# Altium schematic sheet dcdc_jetson.SchDoc
size A3; SheetNumber: 3; SheetTotal: 3
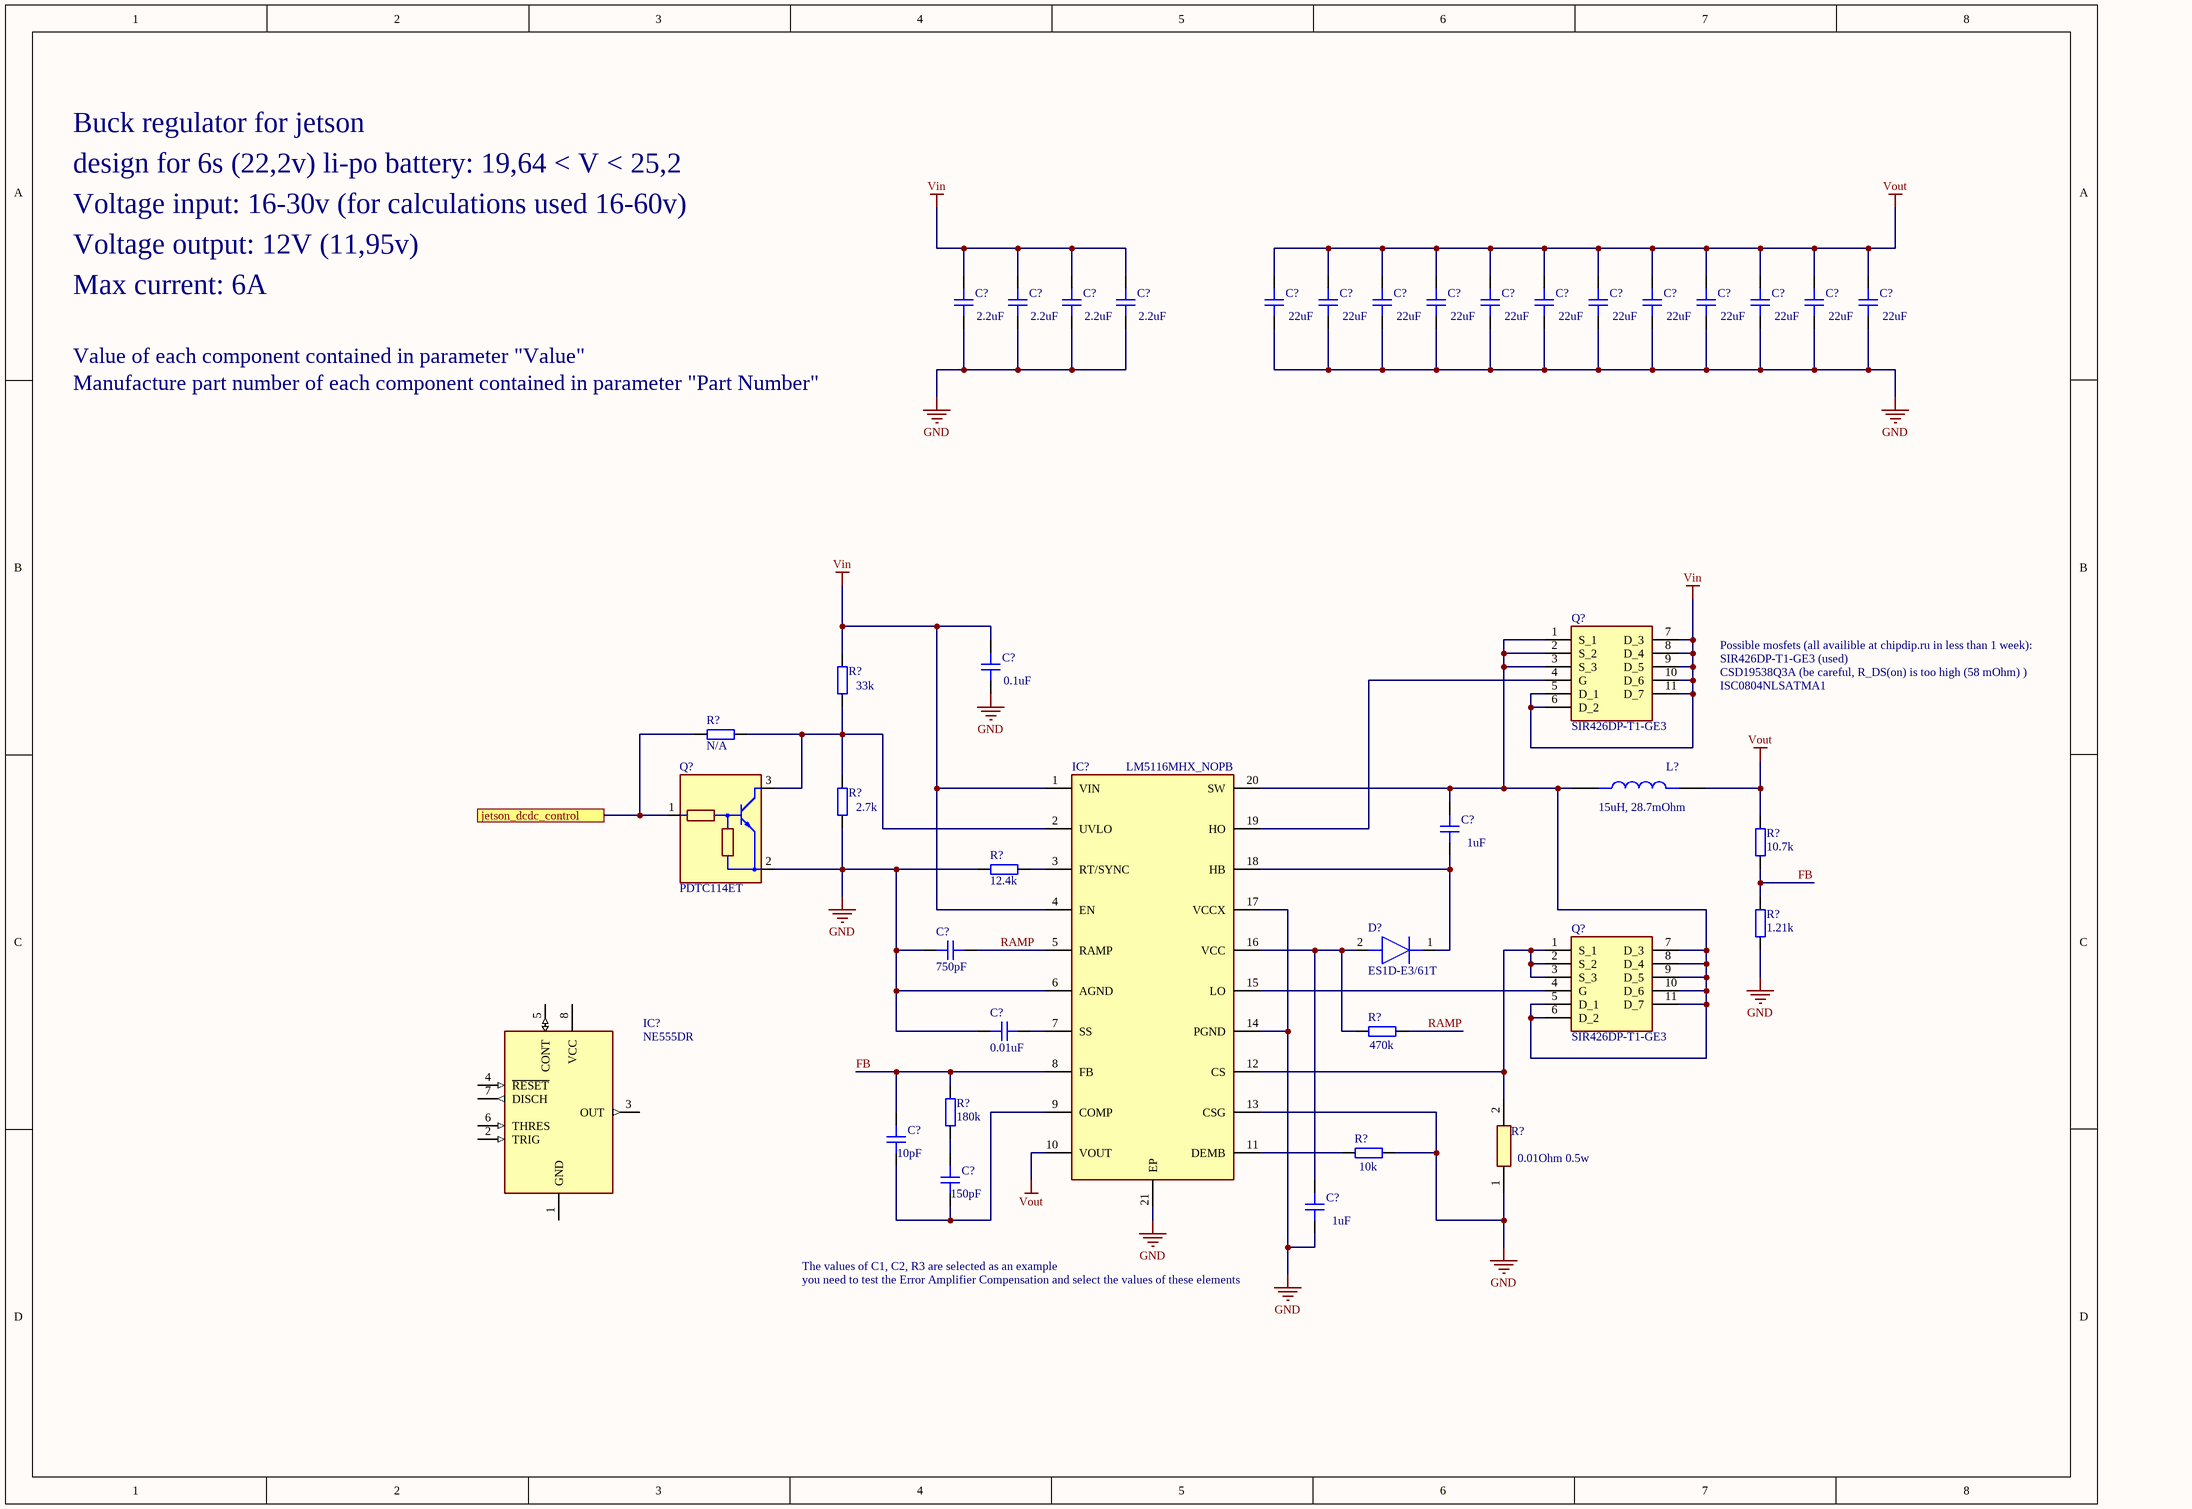
[diagram p0: dcdc_jetson.SchDoc]

## Parts
(Parts that share a designator on the sheet are numbered #1, #2 ... from top to bottom, then left to right.)
C?#1  value 2.2uF  [CAP_1206]  (hidden comment: C1206)
C?#2  value 2.2uF  [CAP_1206]  (hidden comment: C1206)
C?#3  value 2.2uF  [CAP_1206]  (hidden comment: C1206)
C?#4  value 2.2uF  [CAP_1206]  (hidden comment: C1206)
C?#5  value 22uF  [CAP_1210]  (hidden comment: C1210)
C?#6  value 22uF  [CAP_1210]  (hidden comment: C1210)
C?#7  value 22uF  [CAP_1210]  (hidden comment: C1210)
C?#8  value 22uF  [CAP_1210]  (hidden comment: C1210)
C?#9  value 22uF  [CAP_1210]  (hidden comment: C1210)
C?#10  value 22uF  [CAP_1210]  (hidden comment: C1210)
C?#11  value 22uF  [CAP_1210]  (hidden comment: C1210)
C?#12  value 22uF  [CAP_1210]  (hidden comment: C1210)
C?#13  value 22uF  [CAP_1210]  (hidden comment: C1210)
C?#14  value 22uF  [CAP_1210]  (hidden comment: C1210)
C?#15  value 22uF  [CAP_1210]  (hidden comment: C1210)
C?#16  value 22uF  [CAP_1210]  (hidden comment: C1210)
C?#17  value 0.1uF  [CAP_0603]  (hidden comment: C0603)
C?#18  value 1uF  [CAP_0603]  (hidden comment: C0603)
C?#19  value 750pF  [CAP_0603]  (hidden comment: C0603)
C?#20  value 0.01uF  [CAP_0603]  (hidden comment: C0603)
C?#21  value 10pF  [CAP_0603]  (hidden comment: C0603)
C?#22  value 150pF  [CAP_0603]  (hidden comment: C0603)
C?#23  value 1uF  [CAP_0603]  (hidden comment: C0603)
D?  Part Number: ES1D-E3/61T  [DIOM5127X229N]
IC?#1  NE555DR  [SOIC127P600X175-8N]
IC?#2  LM5116MHX_NOPB  [SOP65P640X110-21N]
L?  value 15uH, 28.7mOhm  [IND_SPRH127-560M]
Q?#1  (no value)  [SIR426DPT1GE3]
Q?#2  PDTC114ET  [SOT95P230X110-3N]
Q?#3  (no value)  [SIR426DPT1GE3]
R?#1  value 33k  [RES_0603]  (hidden comment: R0603)
R?#2  R0603  [RES_0603]  (value not drawn)
R?#3  value 2.7k  [RES_0603]  (hidden comment: R0603)
R?#4  value 10.7k  [RES_0402]  (hidden comment: R0402)
R?#5  value 12.4k  [RES_0603]  (hidden comment: R0603)
R?#6  value 1.21k  [RES_0402]  (hidden comment: R0402)
R?#7  value 470k  [RES_0603]  (hidden comment: R0603)
R?#8  value 180k  [RES_0603]  (hidden comment: R0603)
R?#9  value 10k  [RES_0603]  (hidden comment: R0603)
R?#10  value 0.01Ohm 0.5w  [RESC3126X65N]

## Ports
jetson_dcdc_control

## Nets
GND: C?#1.1 C?#2.1 C?#3.1 C?#4.1 C?#5.1 C?#6.1 C?#7.1 C?#8.1 C?#9.1 C?#10.1 C?#11.1 C?#12.1 C?#13.1 C?#14.1 C?#15.1 C?#16.1 C?#17.1 C?#19.2 C?#20.2 C?#23.1 IC?#2.6(AGND) IC?#2.13(CSG) IC?#2.14(PGND) IC?#2.17(VCCX) IC?#2.21(EP) Q?#2.2(E) R?#3.1 R?#5.2 R?#6.1 R?#9.2 R?#10.1
Vin: C?#1.2 C?#2.2 C?#3.2 C?#4.2 C?#17.2 IC?#2.1(VIN) IC?#2.4(EN) Q?#1.5(D_1) Q?#1.6(D_2) Q?#1.7(D_3) Q?#1.8(D_4) Q?#1.9(D_5) Q?#1.10(D_6) Q?#1.11(D_7) R?#1.2
Vout: C?#5.2 C?#6.2 C?#7.2 C?#8.2 C?#9.2 C?#10.2 C?#11.2 C?#12.2 C?#13.2 C?#14.2 C?#15.2 C?#16.2 IC?#2.10(VOUT) L?.2 R?#4.1
FB: C?#21.2 IC?#2.8(FB) R?#4.2 R?#6.2 R?#8.1
jetson_dcdc_control: Q?#2.1(B) R?#2.2 ; port jetson_dcdc_control
RAMP: C?#19.1 IC?#2.5(RAMP) R?#7.2
NetC?#18_1: C?#18.1 D?.1(K) IC?#2.18(HB)
NetC?#18_2: C?#18.2 IC?#2.20(SW) L?.1 Q?#1.1(S_1) Q?#1.2(S_2) Q?#1.3(S_3) Q?#3.5(D_1) Q?#3.6(D_2) Q?#3.7(D_3) Q?#3.8(D_4) Q?#3.9(D_5) Q?#3.10(D_6) Q?#3.11(D_7)
NetC?#20_1: C?#20.1 IC?#2.7(SS)
NetC?#21_1: C?#21.1 C?#22.1 IC?#2.9(COMP)
NetC?#22_2: C?#22.2 R?#8.2
NetC?#23_2: C?#23.2 D?.2(A) IC?#2.16(VCC) R?#7.1
NetIC?#2_2: IC?#2.2(UVLO) Q?#2.3(C) R?#1.1 R?#2.1 R?#3.2
NetIC?#2_3: IC?#2.3(RT/SYNC) R?#5.1
NetIC?#2_11: IC?#2.11(DEMB) R?#9.1
NetIC?#2_12: IC?#2.12(CS) Q?#3.1(S_1) Q?#3.2(S_2) Q?#3.3(S_3) R?#10.2
NetIC?#2_15: IC?#2.15(LO) Q?#3.4(G)
NetIC?#2_19: IC?#2.19(HO) Q?#1.4(G)

Not connected (* = marked no-connect by the designer): IC?#1 1(GND) 2(TRIG) 3(OUT) 4(~{RESET}) 5(CONT) 6(THRES) 7(DISCH) 8(VCC)

## Notes on the sheet
- design for 6s (22,2v) li-po battery: 19,64 < V < 25,2
- Buck regulator for jetson
- Voltage input: 16-30v (for calculations used 16-60v)
- Voltage output: 12V (11,95v)
- Max current: 6A
- Value of each component contained in parameter "Value"
- Manufacture part number of each component contained in parameter "Part Number"
- Possible mosfets (all availible at chipdip.ru in less than 1 week):
- CSD19538Q3A (be careful, R_DS(on) is too high (58 mOhm) )
- SIR426DP-T1-GE3 (used)
- ISC0804NLSATMA1
- The values of C1, C2, R3 are selected as an example
- you need to test the Error Amplifier Compensation and select the values of these elements

## Library data of the parts
C?#1-C?#4 = CAP_1206: Capacitor SMD 1206; Part Number: GRM31CR72A225KA73L; Voltage (V): 100; LCSC: *; Rating: *; Dielectric: *
C?#5-C?#16 = CAP_1210: Capacitor SMD 1210; Part Number: GRM32ER71E226KE15L; Voltage (V): 25; LCSC: *; Rating: *; Dielectric: *
C?#17 = CAP_0603: Capacitor SMD 0603; Part Number: GRM188R72A104KA35D; Voltage (V): 100; LCSC: *; Rating: *; Dielectric: *
C?#18 C?#23 = CAP_0603: Capacitor SMD 0603; Part Number: GRM188R61H105KAALD; Voltage (V): 25; LCSC: *; Rating: *; Dielectric: *
C?#19 = CAP_0603: Capacitor SMD 0603; Part Number: GRM1885C1H751J; Dielecrtic: COG(NP0); LCSC: *; Rating: *; Dielectric: *
C?#20 = CAP_0603: Capacitor SMD 0603; Part Number: GRM188R71H103KA01D; LCSC: *; Rating: *; Dielectric: *
C?#21 = CAP_0603: Capacitor SMD 0603; Part Number: GRM1885C1H100JA01D; Voltage (V): 25; Dielectric: C0G(NP0); LCSC: *; Rating: *
C?#22 = CAP_0603: Capacitor SMD 0603; Part Number: GRM1885C1H151JA01D; Voltage (V): 25; Dielectric: C0G(NP0); LCSC: *; Rating: *
D? = ES1D-E3_61T: Diode; Manufacturer_Name: Vishay
IC?#1 = NE555DR: Integrated Circuit; Manufacturer_Name: Texas Instruments; Datasheet Link: http://www.ti.com/lit/ds/symlink/ne555.pdf; Height: 1.75mm; Manufacturer_Part_Number: NE555DR; Mouser Part Number: 595-NE555DR; Mouser Price/Stock: https://www.mouser.com/Search/Refine.aspx?Keyword=595-NE555DR; RS Part Number: 1218414; RS Price/Stock: http://uk.rs-online.com/web/p/products/1218414
IC?#2 = LM5116MHX_NOPB: Integrated Circuit; Manufacturer_Name: Texas Instruments; Manufacturer_Part_Number: LM5116MHX/NOPB; Part Number: LM5116MHX_NOPB; Height: 1.1mm; Mouser Part Number: 926-LM5116MHX/NOPB; Mouser Price/Stock: https://www.mouser.co.uk/ProductDetail/Texas-Instruments/LM5116MHX-NOPB?qs=QbsRYf82W3EaCl%2FW15P7yA%3D%3D; Arrow Part Number: LM5116MHX/NOPB; Arrow Price/Stock: https://www.arrow.com/en/products/lm5116mhxnopb/texas-instruments?region=nac
L? = SPRH127-560M: MP: SPRH127-150M; Package: None; Price: None; Availability: Unavailable; Part Number: SPRH127-150M
Q?#1 Q?#3 = SIR426DP-T1-GE3: MOSFET (N-Channel); Part Number: SIR426DP-T1-GE3
Q?#2 = PDTC114ET: Transistor RET NPN; Part Number: PDTC114ET,215; Manufacturer_Name: Nexperia; Datasheet Link: https://assets.nexperia.com/documents/data-sheet/PDTC114E_SER.pdf; Manufacturer_Part_Number: PDTC114ET; Mouser Part Number: N/A; Mouser Price/Stock: https://www.mouser.co.uk/ProductDetail/Nexperia/PDTC114ET?qs=vHuUswq2%252BsxH5JWL8htR%2FQ%3D%3D
R?#1 = RES_0603: Resistor SMD 0603; Part Number: RC0603FR-0733KL; Manufacturer Part Number: *; Distributor Link: *; LCSC: *
R?#2 = RES_0603: Resistor SMD 0603; Manufacturer Part Number: *; Distributor Link: *; LCSC: *; Value: N/A
R?#3 = RES_0603: Resistor SMD 0603; Part Number: RC0603JR-072K7L; Manufacturer Part Number: *; Distributor Link: *; LCSC: *
R?#4 R?#6 = RES_0402: Resistor SMD 0402; Part Number: RC0402FR-071K21L; Distributor Link: *; LCSC: *
R?#5 = RES_0603: Resistor SMD 0603; Part Number: RC0603FR-0712K4L; Manufacturer Part Number: *; Distributor Link: *; LCSC: *
R?#7 = RES_0603: Resistor SMD 0603; Part Number: RC0603FR-07470KL; Distributor Link: *; LCSC: *
R?#8 = RES_0603: Resistor SMD 0603; Part Number: RC0603FR-07180KL; Distributor Link: *; LCSC: *
R?#9 = RES_0603: Resistor SMD 0603; Part Number: AC0603FR-0710KL; Distributor Link: *; LCSC: *
R?#10 = RL1210FR-070R1L: Resistor; Part Number: RL1210FR-070R01L; Footprint: 1210